# Altium schematic sheet Uart.SchDoc
size A; SheetNumber: 2; SheetTotal: 6
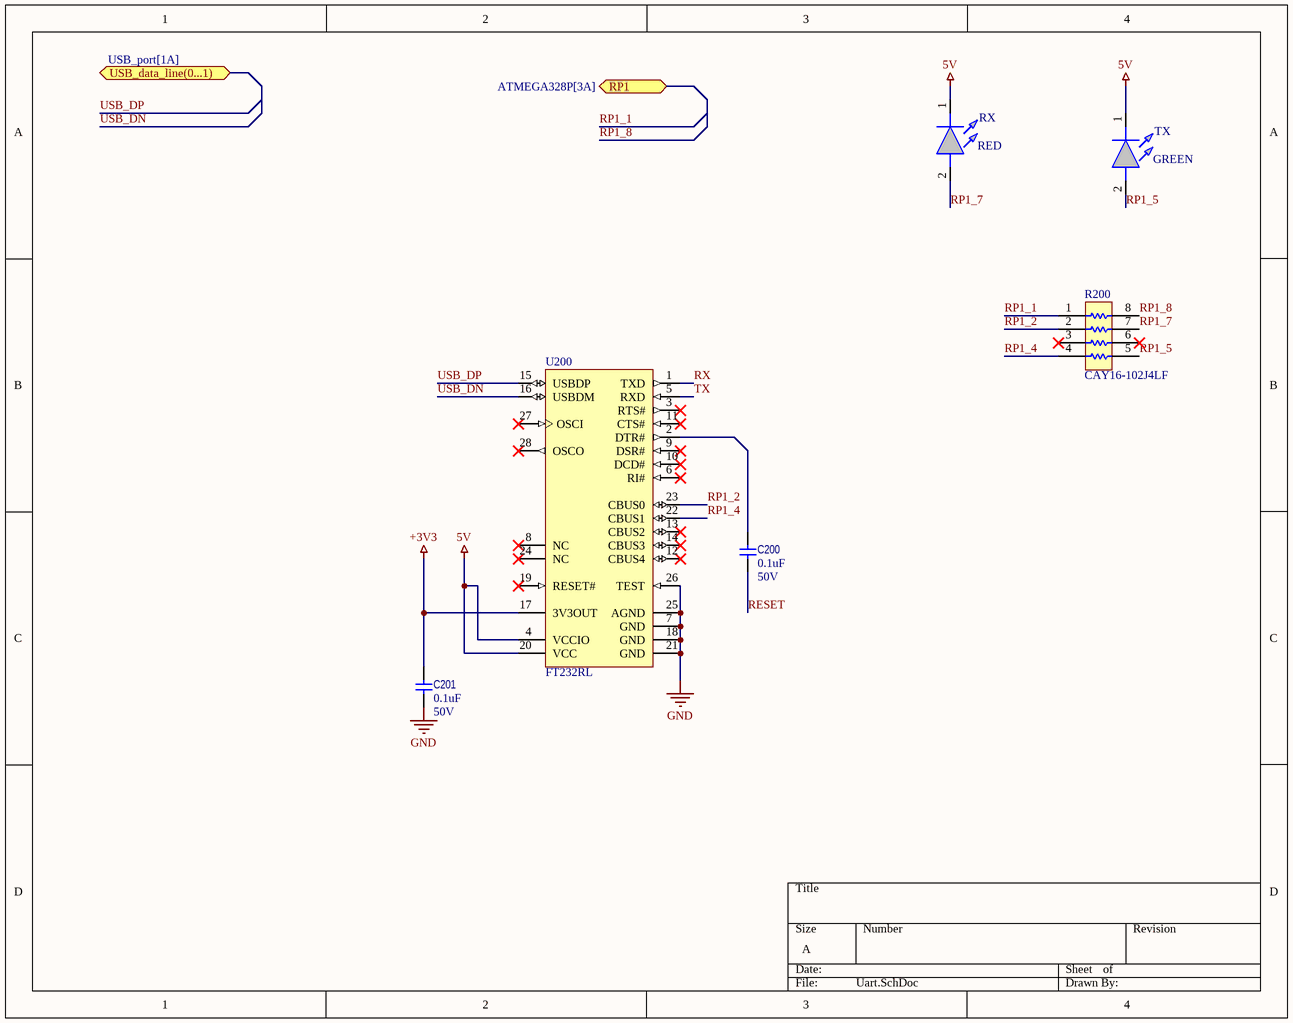
[diagram p0: Uart.SchDoc]

## Parts
C200  Voltage_Rating: 50V  [CAPC1005X55N]  (hidden comment: 0.1uF)
C201  Voltage_Rating: 50V  [CAPC1005X55N]  (hidden comment: 0.1uF)
R200  CAY16-102J4LF  [BOUR-CAY16-J4_V]
RX  COLOR: RED  [LEDC2012X75N]  (hidden comment: KPT-2012YC)
TX  COLOR: GREEN  [LEDC2012X75N]  (hidden comment: KPT-2012YC)
U200  FT232RL  [FTDI-SSOP-28_M]

## Ports
RP1 (bidir, see ATMEGA328P[3A]), USB_data_line(0...1) (bidir, see USB_port[1A])

## Nets
5V: RX.1(K) TX.1(K) U200.4(VCCIO) U200.20(VCC)
+3V3: C201.1 U200.17(3V3OUT)
GND: C201.2 U200.7(GND) U200.18(GND) U200.21(GND) U200.25(AGND) U200.26(TEST)
RESET: C200.2
RP1_1: R200.1
RP1_2: R200.2 U200.23(CBUS0)
RP1_4: R200.4 U200.22(CBUS1)
RP1_5: R200.5 TX.2(A)
RP1_7: R200.7 RX.2(A)
RP1_8: R200.8
RX: U200.1(TXD)
TX: U200.5(RXD)
USB_DN: U200.16(USBDM)
USB_DP: U200.15(USBDP)
NetC200_1: C200.1 U200.2(DTR#)

Not connected (* = marked no-connect by the designer): R200 3* 6*; U200 3(RTS#)* 6(RI#)* 8(NC)* 9(DSR#)* 10(DCD#)* 11(CTS#)* 12(CBUS4)* 13(CBUS2)* 14(CBUS3)* 19(RESET#)* 24(NC)* 27(OSCI)* 28(OSCO)*

## Library data of the parts
C200 C201 = 30041: CAP CER 0.1uF ±10% 50V X7R 0603 (1608 Metric); Part_Type: Capacitor; Manufacturer Part Number: C0603C104K5RECAUTO; Manufacturer: KEMET; Part_Status: New; ID: 30041; Updated By: randy; Sorted_Value: 1E-7; Value: 0.1uF; Sub_Type: CER; Manufacturer Part Description: CAP CER 0.1uF ±10% 50V X7R 0603 (1608 Metric); Supplier 1: DigiKey; Supplier Part Number 1: 399-14105-2-ND; Package_Case: 0603 (1608 Metric); RoHS: Yes; Temperature Range: -55C to +125C; Dielectric: X7R; Tolerance: ±10%; Created By: randy; Created_Date: 2024-03-31 22:55:42; Updated_Date: 2024-03-31 22:57:36; ComponentLink1Description: Datasheet; ComponentLink2Description: Supplier Part Details; ComponentLink2URL: https://www.digikey.com/products/en?keywords=C0603C104K5RECAUTO; Symbol Ref: CAP_NOPOL; Size / Dimension: 0.063in L x 0.031in W (1.60mm x 0.80mm)
R200 = CMP-1747-00007-1: Chip Resistor Array, 1 KOhm, +/- 5%, 62.5 mW, -55 to 125 degC, 8-Pin SMD, RoHS, Tape and Reel; Power Rating: 100 mW; Tolerance: 1%; Voltage Rating (DC): 50 V; Resistance: 330 Ohm; Case\Package: 0603; RoHSCompliant: true; Case Code (Metric): 1608; Pins: 2; PackageDescription: 8-Pin Surface Mount Device, Body 1.6 x 3.2 mm, Pitch 0.8 mm; Height: 0.45 mm; Min Operating Temperature: -55 degC; ComponentLink1URL: http://www.bourns.com/; Case Code (Imperial): 0603; Packaging: Tape and Reel; PackageReference: CAY16-J4; ComponentLink1Description: Manufacturer URL; ComponentLink2Description: Datasheet; Length: 1.6 mm; Width: 0.8 mm; Max Operating Temperature: 155 degC; Mount: Surface Mount; DatasheetVersion: Sep-14; Voltage Rating: 50 V; REACH SVHC: No SVHC; ComponentLink2URL: http://www.bourns.com/pdfs/CATCAY.pdf; Package Quantity: 5000
RX TX = KPT-2012YC: Kingbright KPT-2012YC Yellow LED, 588 nm, 2012 (0805), Rectangle Lens SMD Package; Geometry.Height: 0.75mm; Newark Part Number: *; Newark Price/Stock: *; Manufacturer_Name: Kingbright; Manufacturer_Part_Number: KPT-2012YC; Datasheet Link: https://componentsearchengine.com/Datasheets/2/KPT-2012YC.pdf
U200 = CMP-2000-05029-1: IC USB FS SERIAL UART 28-SSOP; Manufacturer: FTDI; Receive FIFO: 256B; Number of Channels per Chip: 1; Maximum Data Rate: 3MBd; Transmit FIFO: 128B; Dimensions: 10.2x5.3x1.75mm; Mounting Type: SurfaceMount; Height: 1.75mm; Package Type: SSOP; Datasheet Version: Rev. 1.04, 02/2006; Width: 5.3mm; Manufacturer URL: http://www.ftdichip.com/; Datasheet URL: http://datasheet.octopart.com/FT232RL-FTDI-datasheet-120501.pdf; Maximum Operating Temperature: +85degC; Minimum Operating Temperature: -40degC; Pin Count: 28; Length: 10.2mm